# EAGLE schematic epnet (EAGLE 7.2.0)
EPNET
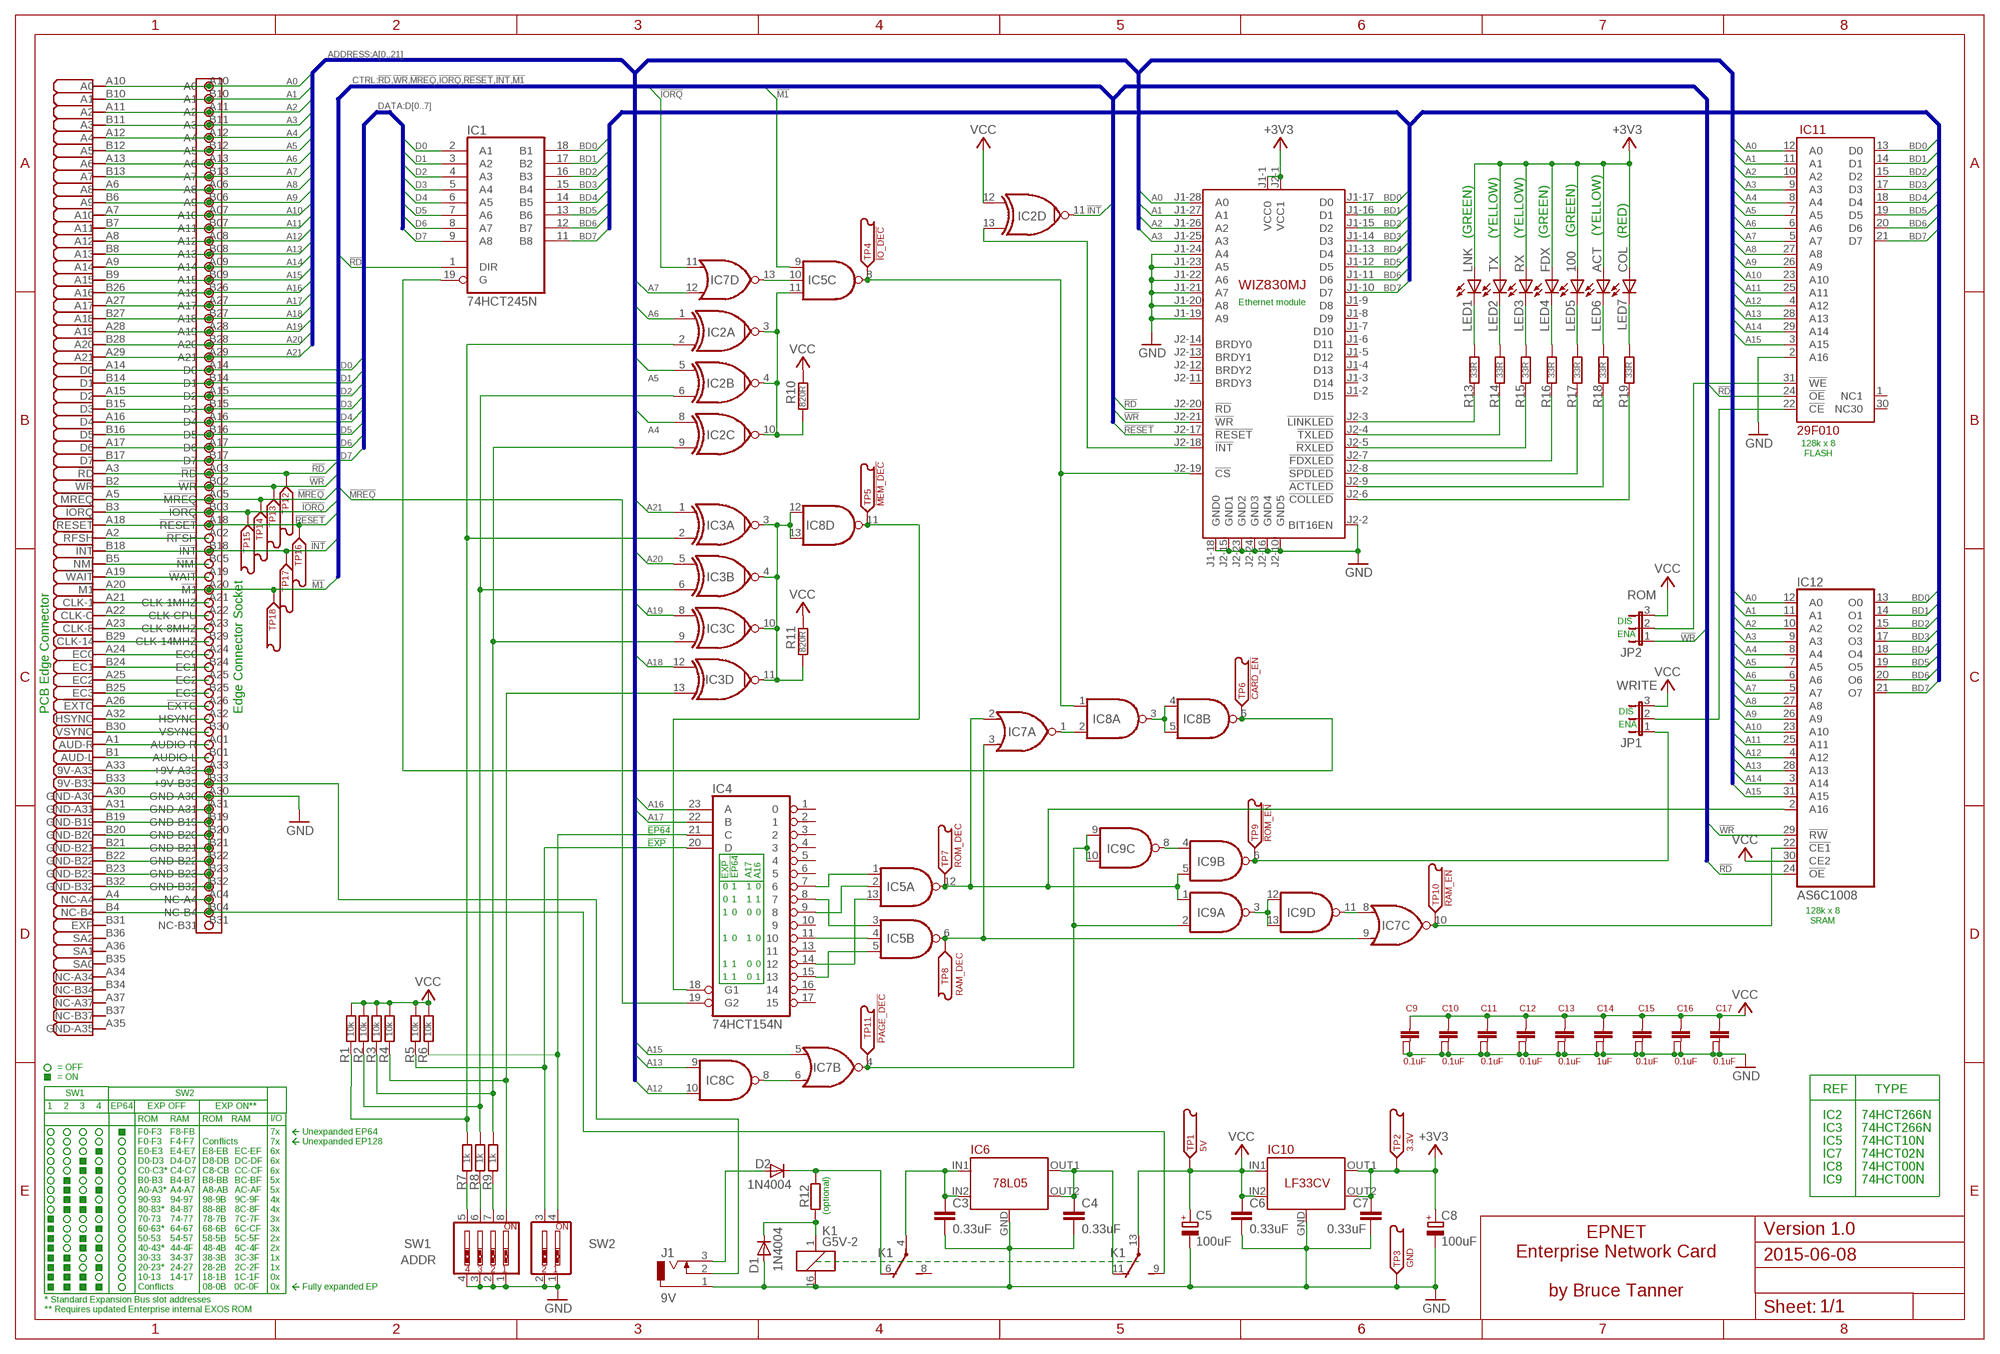
[diagram p0: schematic, sheet 1]

## Parts
C1  Edge Connector  CON-EDGE  [CON-EDGE]
C2  CON-EXPANSION  [EXPSOCKET]
C3  0.33uF  C-EU050-025X075  [C050-025X075]
C4  0.33uF  C-EU050-025X075  [C050-025X075]
C5  100uF  CPOL-EUE2.5-7  [E2,5-7]
C6  0.33uF  C-EU050-025X075  [C050-025X075]
C7  0.33uF  C-EU050-025X075  [C050-025X075]
C8  100uF  CPOL-EUE2.5-7  [E2,5-7]
C9  0.1uF  CAPACITOR  [CAPACITOR]
C10  0.1uF  CAPACITOR  [CAPACITOR]
C11  0.1uF  CAPACITOR  [CAPACITOR]
C12  0.1uF  CAPACITOR  [CAPACITOR]
C13  0.1uF  CAPACITOR  [CAPACITOR]
C14  1uF  CAPACITOR  [CAPACITOR]
C15  0.1uF  CAPACITOR  [CAPACITOR]
C16  0.1uF  CAPACITOR  [CAPACITOR]
C17  0.1uF  CAPACITOR  [CAPACITOR]
D1  1N4004  [DO41-10]
D2  1N4004  [DO41-10]
IC1  74HCT245N  74LS245N  [DIL20]
IC2  74LS266N  [DIL14]
IC3  74LS266N  [DIL14]
IC4  74HCT154N  74154N  [DIL24-6]
IC5  74AS10N  [DIL14]
IC6  78L05  REGULATOR  [REGULATOR]
IC7  74LS02N  [DIL14]
IC8  74LS00N  [DIL14]
IC9  74LS00N  [DIL14]
IC10  LF33CV  REGULATOR  [REGULATOR]
IC11  29F010  [20F010]
IC12  AS6C1008  TC551001CP  [DIL32]
J1  9V  DCJ0202  [DCJ0202]
JP1  WRITE  JP2E  [JP2]
JP2  ROM  JP2E  [JP2]
K1  G5V-2  [G5V-2]
LED1  LNK  LED3MM  [LED3MM]
LED2  TX  LED3MM  [LED3MM]
LED3  RX  LED3MM  [LED3MM]
LED4  FDX  LED3MM  [LED3MM]
LED5  100  LED3MM  [LED3MM]
LED6  ACT  LED3MM  [LED3MM]
LED7  COL  LED3MM  [LED3MM]
M1  WIZ830MJ  [WIZ830MJ]
R1  10k  R-EU_0309/10  [0309/10]
R2  10k  R-EU_0309/10  [0309/10]
R3  10k  R-EU_0309/10  [0309/10]
R4  10k  R-EU_0309/10  [0309/10]
R5  10k  R-EU_0309/10  [0309/10]
R6  10k  R-EU_0309/10  [0309/10]
R7  1k  R-EU_0309/10  [0309/10]
R8  1k  R-EU_0309/10  [0309/10]
R9  1k  R-EU_0309/10  [0309/10]
R10  820R  R-EU_0309/10  [0309/10]
R11  820R  R-EU_0309/10  [0309/10]
R12  R-EU_0309/10  [0309/10]
R13  33R  R-EU_0309/10  [0309/10]
R14  33R  R-EU_0309/10  [0309/10]
R15  33R  R-EU_0309/10  [0309/10]
R16  33R  R-EU_0309/10  [0309/10]
R17  33R  R-EU_0309/10  [0309/10]
R18  33R  R-EU_0309/10  [0309/10]
R19  33R  R-EU_0309/10  [0309/10]
SW1  ADDR  SW_DIP-4  [EDG-04]
SW2  SW_DIP-2  [EDG-02]
TP1  5V  TESTPOINT  [TESTPOINT]
TP2  3.3V  TESTPOINT  [TESTPOINT]
TP3  GND  TESTPOINT  [TESTPOINT]
TP4  !IO_DEC  TESTPOINT  [TESTPOINT]
TP5  !MEM_DEC  TESTPOINT  [TESTPOINT]
TP6  !CARD_EN  TESTPOINT  [TESTPOINT]
TP7  ROM_DEC  TESTPOINT  [TESTPOINT]
TP8  RAM_DEC  TESTPOINT  [TESTPOINT]
TP9  !ROM_EN  TESTPOINT  [TESTPOINT]
TP10  !RAM_EN  TESTPOINT  [TESTPOINT]
TP11  !PAGE_DEC  TESTPOINT  [TESTPOINT]
TP12  !RD  TESTPOINT  [TESTPOINT]
TP13  !WR  TESTPOINT  [TESTPOINT]
TP14  !MREQ  TESTPOINT  [TESTPOINT]
TP15  !IORQ  TESTPOINT  [TESTPOINT]
TP16  !RESET  TESTPOINT  [TESTPOINT]
TP17  !INT  TESTPOINT  [TESTPOINT]
TP18  !M1  TESTPOINT  [TESTPOINT]

## Nets
!CARD_ENABLE: IC1.19(G) IC8.6(B:O) TP6.P$1(TESTPOINT)
!EP64: IC4.21(C) R6.1 SW2.4
!INT: C1.B18(!INT) C2.B18(!INT) IC2.11(D:O) TP17.P$1(TESTPOINT)
!IO_DECODE: IC5.8(C:O) IC8.1(A:I0) M1.J2-19(!CS) TP4.P$1(TESTPOINT)
!IORQ: C1.B3(!IORQ) C2.B03(!IORQ) IC7.11(D:I0) TP15.P$1(TESTPOINT)
!M1: C1.A20(!M1) C2.A20(!M1) IC5.9(C:I0) TP18.P$1(TESTPOINT)
!MEM_DEC: IC4.18(G1) IC8.11(D:O) TP5.P$1(TESTPOINT)
!MREQ: C1.A5(!MREQ) C2.A05(!MREQ) IC4.19(G2) TP14.P$1(TESTPOINT)
!RAM_ENABLE: IC7.10(C:O) IC12.22(!CE1) TP10.P$1(TESTPOINT)
!RD: C1.A3(!RD) C2.A03(!RD) IC1.1(DIR) IC11.24(!OE) IC12.24(!OE) M1.J2-20(!RD) TP12.P$1(TESTPOINT)
!RESET: C1.A18(!RESET) C2.A18(!RESET) M1.J2-17(!RESET) TP16.P$1(TESTPOINT)
!ROM_ENABLE: IC9.6(B:O) JP1.1 TP9.P$1(TESTPOINT)
!WR: C1.B2(!WR) C2.B02(!WR) IC12.29(!RW) JP2.1 M1.J2-21(!WR) TP13.P$1(TESTPOINT)
+3V3: C7.1 C8.+ IC10.OUT1 IC10.OUT2 LED1.A LED2.A LED3.A LED4.A LED5.A LED6.A LED7.A M1.J1-1(VCC0) M1.J2-1(VCC1) TP2.P$1(TESTPOINT)
A0: C1.A10(A0) C2.A10(A0) IC11.12(A0) IC12.12(A0) M1.J1-28(A0)
A1: C1.B10(A1) C2.B10(A1) IC11.11(A1) IC12.11(A1) M1.J1-27(A1)
A2: C1.A11(A2) C2.A11(A2) IC11.10(A2) IC12.10(A2) M1.J1-26(A2)
A3: C1.B11(A3) C2.B11(A3) IC11.9(A3) IC12.9(A3) M1.J1-25(A3)
A4: C1.A12(A4) C2.A12(A4) IC2.8(C:I0) IC11.8(A4) IC12.8(A4)
A5: C1.B12(A5) C2.B12(A5) IC2.5(B:I0) IC11.7(A5) IC12.7(A5)
A6: C1.A13(A6) C2.A13(A6) IC2.1(A:I0) IC11.6(A6) IC12.6(A6)
A7: C1.B13(A7) C2.B13(A7) IC7.12(D:I1) IC11.5(A7) IC12.5(A7)
A8: C1.A6(A8) C2.A06(A8) IC11.27(A8) IC12.27(A8)
A9: C1.B6(A9) C2.B06(A9) IC11.26(A9) IC12.26(A9)
A10: C1.A7(A10) C2.A07(A10) IC11.23(A10) IC12.23(A10)
A11: C1.B7(A11) C2.B07(A11) IC11.25(A11) IC12.25(A11)
A12: C1.A8(A12) C2.A08(A12) IC8.10(C:I1) IC11.4(A12) IC12.4(A12)
A13: C1.B8(A13) C2.B08(A13) IC8.9(C:I0) IC11.28(A13) IC12.28(A13)
A14: C1.A9(A14) C2.A09(A14) IC11.29(A14) IC12.3(A14)
A15: C1.B9(A15) C2.B09(A15) IC7.5(B:I0) IC11.3(A15) IC12.31(A15)
A16: C1.B26(A16) C2.B26(A16) IC4.23(A)
A17: C1.A27(A17) C2.A27(A17) IC4.22(B)
A18: C1.B27(A18) C2.B27(A18) IC3.12(D:I0)
A19: C1.A28(A19) C2.A28(A19) IC3.8(C:I0)
A20: C1.B28(A20) C2.B28(A20) IC3.5(B:I0)
A21: C1.A29(A21) C2.A29(A21) IC3.1(A:I0)
BD0: IC1.18(B1) IC11.13(D0) IC12.13(O0) M1.J1-17(D0)
BD1: IC1.17(B2) IC11.14(D1) IC12.14(O1) M1.J1-16(D1)
BD2: IC1.16(B3) IC11.15(D2) IC12.15(O2) M1.J1-15(D2)
BD3: IC1.15(B4) IC11.17(D3) IC12.17(O3) M1.J1-14(D3)
BD4: IC1.14(B5) IC11.18(D4) IC12.18(O4) M1.J1-13(D4)
BD5: IC1.13(B6) IC11.19(D5) IC12.19(O5) M1.J1-12(D5)
BD6: IC1.12(B7) IC11.20(D6) IC12.20(O6) M1.J1-11(D6)
BD7: IC1.11(B8) IC11.21(D7) IC12.21(O7) M1.J1-10(D7)
D0: C1.A14(D0) C2.A14(D0) IC1.2(A1)
D1: C1.B14(D1) C2.B14(D1) IC1.3(A2)
D2: C1.A15(D2) C2.A15(D2) IC1.4(A3)
D3: C1.B15(D3) C2.B15(D3) IC1.5(A4)
D4: C1.A16(D4) C2.A16(D4) IC1.6(A5)
D5: C1.B16(D5) C2.B16(D5) IC1.7(A6)
D6: C1.A17(D6) C2.A17(D6) IC1.8(A7)
D7: C1.B17(D7) C2.B17(D7) IC1.9(A8)
GND: C1.A30(GND-A30) C1.A31(GND-A31) C1.B19(GND-B19) C1.B20(GND-B20) C1.B21(GND-B21) C1.B22(GND-B22) C1.B23(GND-B23) C1.B32(GND-B32) C2.A30(GND-A30) C2.A31(GND-A31) C2.B19(GND-B19) C2.B20(GND-B20) C2.B21(GND-B21) C2.B22(GND-B22) C2.B23(GND-B23) C2.B32(GND-B32) C3.2 C4.2 C5.- C6.2 C7.2 C8.- C9.P$2 C9.P$3 C10.P$2 C10.P$3 C11.P$2 C11.P$3 C12.P$2 C12.P$3 C13.P$2 C13.P$3 C14.P$2 C14.P$3 C15.P$2 C15.P$3 C16.P$2 C16.P$3 C17.P$2 C17.P$3 D1.A IC6.GND IC10.GND IC11.2(A16) J1.1 K1.16 M1.J1-18(GND0) M1.J1-19(A9) M1.J1-20(A8) M1.J1-21(A7) M1.J1-22(A6) M1.J1-23(A5) M1.J1-24(A4) M1.J2-2(BIT16EN) M1.J2-10(GND5) M1.J2-15(GND1) M1.J2-16(GND4) M1.J2-23(GND2) M1.J2-24(GND3) SW1.1 SW1.2 SW1.3 SW1.4 SW2.1 SW2.2 TP3.P$1(TESTPOINT)
N$1: C1.A2(!RFSH) C2.A02(!RFSH)
N$3: IC9.4(B:I0) IC9.8(C:O)
N$4: R7.1 SW1.5
N$5: IC3.13(D:I1) R4.1 SW1.8
N$6: R8.1 SW1.6
N$7: R9.1 SW1.7
N$8: M1.J2-3(!LINKLED) R13.1
N$9: IC4.7 IC5.1(A:I0)
N$10: IC5.10(C:I1) IC7.13(D:O)
N$11: IC4.8 IC5.3(B:I0)
N$12: IC4.15 IC5.5(B:I2)
N$13: IC2.9(C:I1) IC3.9(C:I1) R3.1 R9.2
N$14: M1.J2-4(!TXLED) R14.1
N$15: IC9.3(A:O) IC9.12(D:I0) IC9.13(D:I1)
N$16: IC4.9 IC5.2(A:I1)
N$17: IC4.11 IC5.4(B:I1)
N$18: IC4.14 IC5.13(A:I2)
N$19: IC7.1(A:O) IC8.2(A:I1)
N$20: IC7.8(C:I0) IC9.11(D:O)
N$21: C1.B5(!NMI) C2.B05(!NMI)
N$22: D1.C K1.1 R12.1
N$24: IC8.3(A:O) IC8.4(B:I0) IC8.5(B:I1)
N$25: IC7.6(B:I1) IC8.8(C:O)
N$27: M1.J2-5(!RXLED) R15.1
N$28: M1.J2-7(!FDXLED) R16.1
N$29: M1.J2-8(!SPDLED) R17.1
N$30: M1.J2-9(!ACTLED) R18.1
N$31: M1.J2-6(!COLLED) R19.1
N$32: LED1.K(C) R13.2
N$33: LED2.K(C) R14.2
N$34: LED3.K(C) R15.2
N$35: LED4.K(C) R16.2
N$36: LED5.K(C) R17.2
N$37: LED6.K(C) R18.2
N$38: LED7.K(C) R19.2
N$39: IC2.3(A:O) IC2.4(B:O) IC2.10(C:O) IC5.11(C:I2) R10.1
N$41: IC3.3(A:O) IC3.4(B:O) IC3.10(C:O) IC3.11(D:O) IC8.12(D:I0) IC8.13(D:I1) R11.1
N$44: IC4.20(D) R5.1 SW2.3
N$46: D2.C K1.6(1:O) R12.2
N$47: D2.A J1.3
N$49: C1.A33(9V-A33) C1.B33(9V-B33) C2.A33(+9V-A33) C2.B33(+9V-B33) J1.2
N$50: IC11.22(!CE) JP1.2
N$51: IC11.31(!WE) JP2.2
N$52: C1.A19(!WAIT) C2.A19(!WAIT)
N$55: C1.A21(CLK-1) C2.A21(CLK-1MHZ)
N$56: C1.A22(CLK-C) C2.A22(CLK-CPU)
N$57: C1.A23(CLK-8) C2.A23(CLK-8MHZ)
N$58: C1.B29(CLK-14) C2.B29(CLK-14MHZ)
N$59: C1.A24(EC0) C2.A24(EC0)
N$60: C1.B24(EC1) C2.B24(EC1)
N$61: C1.A25(EC2) C2.A25(EC2)
N$62: C1.B25(EC3) C2.B25(EC3)
N$63: C1.A26(!EXTC) C2.A26(!EXTC)
N$64: C1.A32(HSYNC) C2.A32(HSYNC)
N$65: C1.B30(VSYNC) C2.B30(VSYNC)
N$66: C1.A1(AUD-R) C2.A01(AUDIO-R)
N$67: C1.B1(AUD-L) C2.B01(AUDIO-L)
N$68: C3.1 IC6.IN1 IC6.IN2 K1.4(1:P)
N$69: C1.A4(NC-A4) C1.B4(NC-B4) C2.A04(NC-A4) C2.B04(NC-B4) K1.9(2:S)
N$70: C4.1 IC6.OUT1 IC6.OUT2 K1.11(2:O)
N$71: IC2.13(D:I1) M1.J2-18(!INT)
PAGE_DECODE: IC7.4(B:O) IC9.2(A:I1) IC9.9(C:I0) IC9.10(C:I1) TP11.P$1(TESTPOINT)
RAM_DECODE: IC5.6(B:O) IC7.3(A:I1) IC7.9(C:I1) TP8.P$1(TESTPOINT)
ROM_DECODE: IC5.12(A:O) IC7.2(A:I0) IC9.1(A:I0) IC9.5(B:I1) IC12.2(A16) TP7.P$1(TESTPOINT)
SA1: IC2.6(B:I1) IC3.6(B:I1) R2.1 R8.2
SA2: IC2.2(A:I1) IC3.2(A:I1) R1.1 R7.2
VCC: C5.+ C6.1 C9.P$1 C10.P$1 C11.P$1 C12.P$1 C13.P$1 C14.P$1 C15.P$1 C16.P$1 C17.P$1 IC2.12(D:I0) IC10.IN1 IC10.IN2 IC12.30(CE2) JP1.3 JP2.3 K1.13(2:P) R1.2 R2.2 R3.2 R4.2 R5.2 R6.2 R10.2 R11.2 TP1.P$1(TESTPOINT)
Unconnected: C1.A34(NC-A34) C1.A36(SA1) C1.A37(NC-A37) C1.B31(!EXP) C1.B34(NC-B34) C1.B35(SA0) C1.B36(SA2) C1.B37(NC-B37) C2.B31(NC-B31) IC4.1 IC4.2 IC4.3 IC4.4 IC4.5 IC4.6 IC4.10 IC4.13 IC4.16 IC4.17 IC11.1(NC1) IC11.30(NC30) IC12.1(NC) K1.8(1:S) M1.J1-2(D15) M1.J1-3(D14) M1.J1-4(D13) M1.J1-5(D12) M1.J1-6(D11) M1.J1-7(D10) M1.J1-8(D9) M1.J1-9(D8) M1.J2-11(BRDY3) M1.J2-12(BRDY2) M1.J2-13(BRDY1) M1.J2-14(BRDY0)

## Buses
ADDRESS:A[0..21]
DATA:D[0..7]
CTRL:!RD,!WR,!MREQ,!IORQ,!RESET,!INT,!M1
DATA:BD[0..7]

## Notes on the sheet
- (GREEN) | (YELLOW) | (YELLOW) | (GREEN) | (GREEN) | (YELLOW) | (RED)
- Ethernet module
- 128k x 8
  FLASH
- DIS
- ENA
- PCB Edge Connector | Edge Connector Socket | DIS
- ENA
- !EP64
- !EXP
- !EXP | !EP64 | A17 | A16
- 0 | 1 | 1 | 0
- 0 | 1 | 1 | 1
- 1 | 0 | 0 | 0
- 128k x 8
  SRAM
- 1 | 0 | 1 | 0
- 1 | 1 | 0 | 0
- 1 | 1 | 0 | 1
- = OFF
- = ON
- REF | TYPE
- SW1 | SW2
- 1 | 2 | 3 | 4 | EP64 | EXP OFF | EXP ON**
- IC2 | 74HCT266N
- ROM | RAM | ROM | RAM | I/O
- IC3 | 74HCT266N
- F0-F3 | F8-FB | 7x | Unexpanded EP64
- F0-F3 | F4-F7 | Conflicts | 7x | Unexpanded EP128 | IC5 | 74HCT10N
- E0-E3 | E4-E7 | E8-EB | EC-EF | 6x
- IC7 | 74HCT02N
- D0-D3 | D4-D7 | D8-DB | DC-DF | 6x
- IC8 | 74HCT00N
- C0-C3* | C4-C7 | C8-CB | CC-CF | 6x
- B0-B3 | B4-B7 | B8-BB | BC-BF | 5x | IC9 | 74HCT00N
- A0-A3* | A4-A7 | A8-AB | AC-AF | 5x
- 90-93 | 94-97 | 98-9B | 9C-9F | 4x
- 80-83* | 84-87 | 88-8B | 8C-8F | 4x | (optional)
- 70-73 | 74-77 | 78-7B | 7C-7F | 3x
- 60-63* | 64-67 | 68-6B | 6C-CF | 3x
- Version 1.0
- 50-53 | 54-57 | 58-5B | 5C-5F | 2x
- 40-43* | 44-4F | 48-4B | 4C-4F | 2x
- 30-33 | 34-37 | 38-3B | 3C-3F | 1x
- EPNET
  Enterprise Network Card
  
  by Bruce Tanner
- 2015-06-08
- 20-23* | 24-27 | 28-2B | 2C-2F | 1x
- 10-13 | 14-17 | 18-1B | 1C-1F | 0x
- Conflicts | 08-0B | 0C-0F | 0x | Fully expanded EP
- * Standard Expansion Bus slot addresses
- ** Requires updated Enterprise internal EXOS ROM

## Power pins joined to a net without a drawn wire
GND: IC1.10(GND) IC2.7(P:GND) IC3.7(P:GND) IC4.12(GND) IC5.7(P:GND) IC7.7(P:GND) IC8.7(P:GND) IC9.7(P:GND) IC11.16(GND) IC12.16(GND)
GND-A35: C1.A35(GND-A35)
VCC: IC1.20(VCC) IC2.14(P:VCC) IC3.14(P:VCC) IC4.24(VCC) IC5.14(P:VCC) IC7.14(P:VCC) IC8.14(P:VCC) IC9.14(P:VCC) IC11.32(VCC) IC12.32(VCC)

## Library data of the parts
C1 = Enterprise:CON-EDGE
C2 = Enterprise:CON-EXPANSION
C3 C4 C6 C7 = resistor:C-EU: CAPACITOR, European symbol
C5 C8 = resistor:CPOL-EU: POLARIZED CAPACITOR, European symbol
C9-C17 = Enterprise:CAPACITOR: Decoupling capacitor
D1 D2 = diode:1N4004: DIODE general purpose rectifier, 1 A
IC1 = Enterprise 74xx-us:74*245: Octal BUS TRANSCEIVER, 3-state
IC2 IC3 = Enterprise 74xx-us:74*266: Quadruple EXCLUSIVE-NOR (XNOR), open-collector
IC4 = Enterprise 74xx-us:74*154: 4-line to 16-line data SELECTOR/MULTIPLEXER
IC5 = Enterprise 74xx-us:74*10: Triple 3-input NAND gate
IC6 IC10 = Enterprise:REGULATOR: Voltage Regulator
IC7 = Enterprise 74xx-us:74*02: Quad 2-input NOR gate
IC8 IC9 = Enterprise 74xx-us:74*00: Quad 2-input NAND gate
IC11 = Enterprise:29F010: 29F010
IC12 = Enterprise memory:TC551001CP: MEMORY
J1 = con-jack:DCJ0202: DC POWER JACK Source: DCJ0202.pdf; OC_FARNELL: unknown; OC_NEWARK: unknown
JP1 JP2 = Enterprise jumper:JP2E: JUMPER
K1 = relay:G5V-2: OMRON PCB Relay Source: http://www.omron.com/ecb/products/pdf/en-g5v2.pdf; MPN: G5V-2 5DC; OC_FARNELL: 9949488; OC_NEWARK: 78K5703
LED1-LED7 = Enterprise led:LED: LED OSRAM: - CHIPLED LG R971, LG N971, LY N971, LG Q971, LY Q971, LO R971, LY R971 LH N974, LH R974 LS Q976, LO Q976, LY Q976 LO Q996 - Hyper CHIPLED LW Q18S LB Q993, LB Q99A, LB R99A - SideLED LS A670, LO A670, LY A670, LG A670, LP A670 LB A673, LV A673, LT A673, LW A673 LH A674 LY A675 LS A676, LA A676, LO A676, LY A676, LW A676 LS A679, LY A679, LG A679 - Hyper Micro SIDELED® LS Y876, LA Y876, LO Y876, LY Y876 LT Y87S - SmartLED LW L88C, LW L88S LB L89C, LB L89S, LG L890 LS L89K, LO L89K, LY L89K LS L896, LA L896, LO L896, LY L896 - TOPLED LS T670, LO T670, LY T670, LG T670, LP T670 LSG T670, LSP T670, LSY T670, LOP T670, LYG T670 LG T671, LOG T671, LSG T671 LB T673, LV T673, LT T673, LW T673 LH T674 LS T676, LA T676, LO T676, LY T676, LB T676, LH T676, LSB T676, LW T676 LB T67C, LV T67C, LT T67C, LS T67K, LO T67K, LY T67K, LW E67C LS E67B, LA E67B, LO E67B, LY E67B, LB E67C, LV E67C, LT E67C LW T67C LS T679, LY T679, LG T679 LS T770, LO T770, LY T770, LG T770, LP T770 LB T773, LV T773, LT T773, LW T773 LH T774 LS E675, LA E675, LY E675, LS T675 LS T776, LA T776, LO T776, LY T776, LB T776 LHGB T686 LT T68C, LB T68C - Hyper Mini TOPLED® LB M676 - Mini TOPLED Santana® LG M470 LS M47K, LO M47K, LY M47K Source: http://www.osram.convergy.de LUXEON: - LUMILED® LXK2-PW12-R00, LXK2-PW12-S00, LXK2-PW14-U00, LXK2-PW14-V00 LXK2-PM12-R00, LXK2-PM12-S00, LXK2-PM14-U00 LXK2-PE12-Q00, LXK2-PE12-R00, LXK2-PE12-S00, LXK2-PE14-T00, LXK2-PE14-U00 LXK2-PB12-K00, LXK2-PB12-L00, LXK2-PB12-M00, LXK2-PB14-N00, LXK2-PB14-P00, LXK2-PB14-Q00 LXK2-PR12-L00, LXK2-PR12-M00, LXK2-PR14-Q00, LXK2-PR14-R00 LXK2-PD12-Q00, LXK2-PD12-R00, LXK2-PD12-S00 LXK2-PH12-R00, LXK2-PH12-S00 LXK2-PL12-P00, LXK2-PL12-Q00, LXK2-PL12-R00 Source: www.luxeon.com KINGBRIGHT: KA-3528ASYC Source: www.kingbright.com
M1 = Enterprise:WIZ830MJ: WIZ80MJ
R1-R19 = resistor:R-EU_: RESISTOR, European symbol
SW1 = special:SW_DIP-4: DIP SWITCH
SW2 = special:SW_DIP-2: DIP SWITCH
TP1-TP18 = Enterprise:TESTPOINT: Test Point

## Net classes
0 default: clearance 0.205 mm